# Altium schematic sheet FPGA_Bank_66_HP.SchDoc: =ProjectName
size 420 x 297 mm; Author: T.P.; CompanyName: WUT; DrawnBy: T.P.; Organization: WUT ISE; Address1: Warsaw Univeristy of Technology; Address2: Nowowiejska 15/19; DocumentNumber: 8; Revision: 0.9; SheetNumber: 8; SheetTotal: 36; EDA_Number: ARTIQ; Projet: ARTIQ/SINARA; ModifiedBy: -; CreateDate: XX/XX/XXXX; CheckedDate: -; Title2: FPGA_Bank_66_HP.SchDoc; DivGrp: ISE; Designer: G.K. and T.P.; ModifiedDate: -; ProjectName: ADC/DAC MEZZANINE
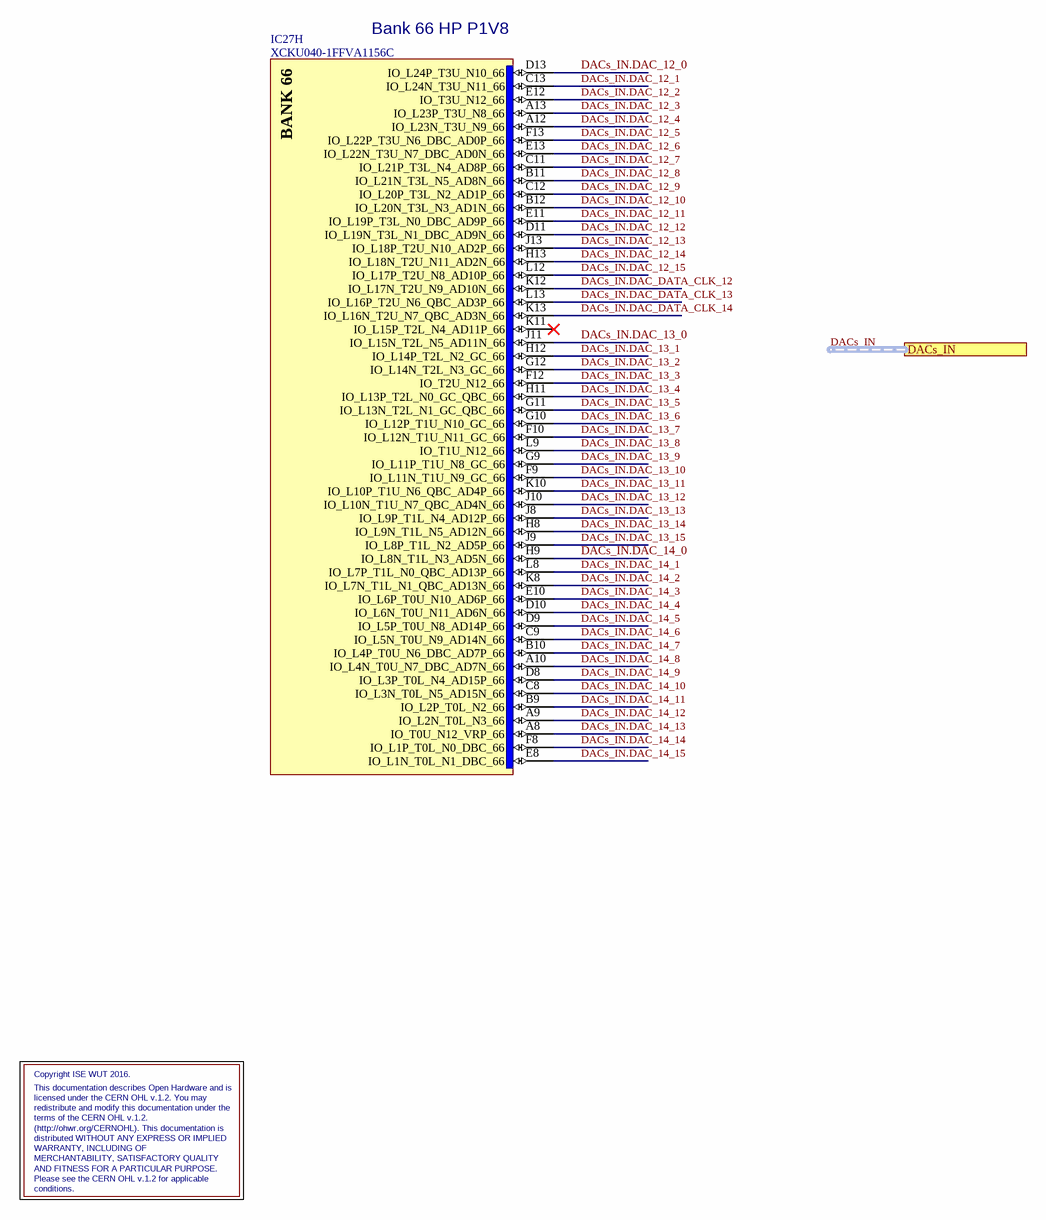
[diagram p0: FPGA_Bank_66_HP.SchDoc]

## Parts
IC27  XCKU040-1FFVA1156C  [BGA1156C100P34X34_3500X3500X350]  (part H of 22)

## Ports
DACs_IN (harness DAC_IN)

## Nets
DACs_IN.DAC_12_0: IC27.D13(IO_L24P_T3U_N10_66)
DACs_IN.DAC_12_1: IC27.C13(IO_L24N_T3U_N11_66)
DACs_IN.DAC_12_2: IC27.E12(IO_T3U_N12_66)
DACs_IN.DAC_12_3: IC27.A13(IO_L23P_T3U_N8_66)
DACs_IN.DAC_12_4: IC27.A12(IO_L23N_T3U_N9_66)
DACs_IN.DAC_12_5: IC27.F13(IO_L22P_T3U_N6_DBC_AD0P_66)
DACs_IN.DAC_12_6: IC27.E13(IO_L22N_T3U_N7_DBC_AD0N_66)
DACs_IN.DAC_12_7: IC27.C11(IO_L21P_T3L_N4_AD8P_66)
DACs_IN.DAC_12_8: IC27.B11(IO_L21N_T3L_N5_AD8N_66)
DACs_IN.DAC_12_9: IC27.C12(IO_L20P_T3L_N2_AD1P_66)
DACs_IN.DAC_12_10: IC27.B12(IO_L20N_T3L_N3_AD1N_66)
DACs_IN.DAC_12_11: IC27.E11(IO_L19P_T3L_N0_DBC_AD9P_66)
DACs_IN.DAC_12_12: IC27.D11(IO_L19N_T3L_N1_DBC_AD9N_66)
DACs_IN.DAC_12_13: IC27.J13(IO_L18P_T2U_N10_AD2P_66)
DACs_IN.DAC_12_14: IC27.H13(IO_L18N_T2U_N11_AD2N_66)
DACs_IN.DAC_12_15: IC27.L12(IO_L17P_T2U_N8_AD10P_66)
DACs_IN.DAC_13_0: IC27.J11(IO_L15N_T2L_N5_AD11N_66)
DACs_IN.DAC_13_1: IC27.H12(IO_L14P_T2L_N2_GC_66)
DACs_IN.DAC_13_2: IC27.G12(IO_L14N_T2L_N3_GC_66)
DACs_IN.DAC_13_3: IC27.F12(IO_T2U_N12_66)
DACs_IN.DAC_13_4: IC27.H11(IO_L13P_T2L_N0_GC_QBC_66)
DACs_IN.DAC_13_5: IC27.G11(IO_L13N_T2L_N1_GC_QBC_66)
DACs_IN.DAC_13_6: IC27.G10(IO_L12P_T1U_N10_GC_66)
DACs_IN.DAC_13_7: IC27.F10(IO_L12N_T1U_N11_GC_66)
DACs_IN.DAC_13_8: IC27.L9(IO_T1U_N12_66)
DACs_IN.DAC_13_9: IC27.G9(IO_L11P_T1U_N8_GC_66)
DACs_IN.DAC_13_10: IC27.F9(IO_L11N_T1U_N9_GC_66)
DACs_IN.DAC_13_11: IC27.K10(IO_L10P_T1U_N6_QBC_AD4P_66)
DACs_IN.DAC_13_12: IC27.J10(IO_L10N_T1U_N7_QBC_AD4N_66)
DACs_IN.DAC_13_13: IC27.J8(IO_L9P_T1L_N4_AD12P_66)
DACs_IN.DAC_13_14: IC27.H8(IO_L9N_T1L_N5_AD12N_66)
DACs_IN.DAC_13_15: IC27.J9(IO_L8P_T1L_N2_AD5P_66)
DACs_IN.DAC_14_0: IC27.H9(IO_L8N_T1L_N3_AD5N_66)
DACs_IN.DAC_14_1: IC27.L8(IO_L7P_T1L_N0_QBC_AD13P_66)
DACs_IN.DAC_14_2: IC27.K8(IO_L7N_T1L_N1_QBC_AD13N_66)
DACs_IN.DAC_14_3: IC27.E10(IO_L6P_T0U_N10_AD6P_66)
DACs_IN.DAC_14_4: IC27.D10(IO_L6N_T0U_N11_AD6N_66)
DACs_IN.DAC_14_5: IC27.D9(IO_L5P_T0U_N8_AD14P_66)
DACs_IN.DAC_14_6: IC27.C9(IO_L5N_T0U_N9_AD14N_66)
DACs_IN.DAC_14_7: IC27.B10(IO_L4P_T0U_N6_DBC_AD7P_66)
DACs_IN.DAC_14_8: IC27.A10(IO_L4N_T0U_N7_DBC_AD7N_66)
DACs_IN.DAC_14_9: IC27.D8(IO_L3P_T0L_N4_AD15P_66)
DACs_IN.DAC_14_10: IC27.C8(IO_L3N_T0L_N5_AD15N_66)
DACs_IN.DAC_14_11: IC27.B9(IO_L2P_T0L_N2_66)
DACs_IN.DAC_14_12: IC27.A9(IO_L2N_T0L_N3_66)
DACs_IN.DAC_14_13: IC27.A8(IO_T0U_N12_VRP_66)
DACs_IN.DAC_14_14: IC27.F8(IO_L1P_T0L_N0_DBC_66)
DACs_IN.DAC_14_15: IC27.E8(IO_L1N_T0L_N1_DBC_66)
DACs_IN.DAC_DATA_CLK_12: IC27.K12(IO_L17N_T2U_N9_AD10N_66)
DACs_IN.DAC_DATA_CLK_13: IC27.L13(IO_L16P_T2U_N6_QBC_AD3P_66)
DACs_IN.DAC_DATA_CLK_14: IC27.K13(IO_L16N_T2U_N7_QBC_AD3N_66)

Not connected (* = marked no-connect by the designer): IC27 K11(IO_L15P_T2L_N4_AD11P_66)*

## Buses and harness runs
harness DACs_IN = port DACs_IN

## Notes on the sheet
- (near IC27) Bank 66 HP P1V8
- Copyright ISE WUT 2016.
- WARRANTY, INCLUDING OF
- redistribute and modify this documentation under the
- distributed WITHOUT ANY EXPRESS OR IMPLIED
- terms of the CERN OHL v.1.2.
- licensed under the CERN OHL v.1.2. You may
- This documentation describes Open Hardware and is
- (http://ohwr.org/CERNOHL). This documentation is
- conditions.
- AND FITNESS FOR A PARTICULAR PURPOSE.
- MERCHANTABILITY, SATISFACTORY QUALITY
- Please see the CERN OHL v.1.2 for applicable
- Project/Equipment
- Document
- Designer
- Drawn by
- Check.by
- File
- Last Mod.
- Print Date
- Sheet
- Size
- A3
- of
- Rev
- (in symbol XCKU040-1FFVA1156C, part H) BANK 66

## Library data of the parts
IC27 = XCKU040-1FFVA1156C: Kintex UltraScale FPGA, 520 I/O, 530K Cells, 1156-Ball BGA, Speed Grade 1, Commercial Grade; Manufacturer: XILINX; Part Description: Kintex UltraScale, 40 DLL I/O, 416 HP I/O, 104 HR I/O, 1156-Pin BGA, Speed Grade 1, Commercial Grade; PressFit: No; Bonding: No; Manufacturer Part Number: XCKU040-1FFVA1156C; PackageDescription: BGA, 1.00mm Pitch, Square; 1156 Pin, 34 Columns X 34 Rows, Body 35.00mm X 35.00mm X 3.50mm H, IPC Medium Density; Part Number: XCKU040-1FFVA1156C; Component Kind: Standard; Component Type: Standard; Device: XCKU040-1FFVA1156C; Pin Count: 1156; Case: BGA1156; Mounted: Yes; Socket: No; SMD: Yes; Sense: No; ComponentHeight: 3.5mm; HelpURL: \\cern.ch\dfs\Applications\Altium\Datasheets\XCKU040-1FFVA1156C.pdf; ComponentLink1URL: \\cern.ch\dfs\Applications\Altium\Datasheets\XCKU040-1FFVA1156C_Package-Pinout.pdf; ComponentLink1Description: Package/Pinout; Author: CERN DEM CA; CreateDate: 16.08.2016; LatestRevisionDate: 16.08.2016